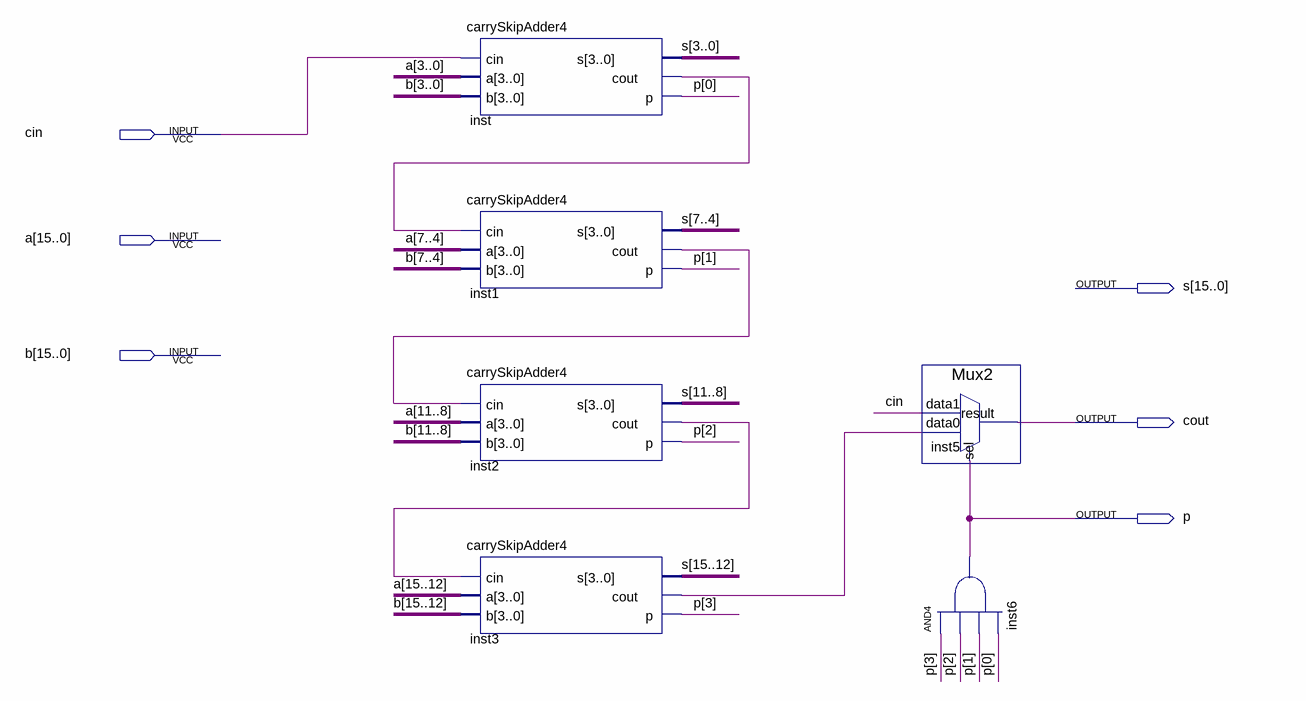
[diagram p0: schematic sheet]
// Quartus schematic carrySkipAdder16.bdf as structural Verilog: 6 symbols, 6 pins
module carrySkipAdder16 (
  input  cin,
  input  [15:0] a,
  input  [15:0] b,
  output [15:0] s,
  output cout,
  output p
);

  wire inst1_cout, inst2_cout, inst3_cout, inst_cout;
  wire [3:0] p_bus;

  carrySkipAdder4 inst (.cin(cin), .a(a[3:0]), .b(b[3:0]), .s(s[3:0]), .cout(inst_cout), .p(p_bus[0]));
  carrySkipAdder4 inst1 (.cin(inst_cout), .a(a[7:4]), .b(b[7:4]), .s(s[7:4]), .cout(inst1_cout), .p(p_bus[1]));
  carrySkipAdder4 inst2 (.cin(inst1_cout), .a(a[11:8]), .b(b[11:8]), .s(s[11:8]), .cout(inst2_cout), .p(p_bus[2]));
  carrySkipAdder4 inst3 (.cin(inst2_cout), .a(a[15:12]), .b(b[15:12]), .s(s[15:12]), .cout(inst3_cout), .p(p_bus[3]));
  Mux2 inst5 (.data1(cin), .data0(inst3_cout), .sel(p), .result(cout));
  and inst6 (p, p_bus[3], p_bus[2], p_bus[1], p_bus[0]);
endmodule
